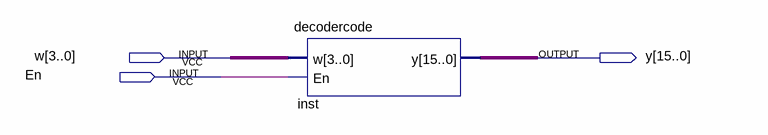
[diagram p0: schematic sheet]
// Quartus schematic decoderschem.bdf as structural Verilog: 1 symbols, 3 pins
module decoderschem (
  input  [3:0] w,
  input  En,
  output [15:0] y
);

  decodercode inst (.w(w), .En(En), .y(y));
endmodule
